# EAGLE board sanguinololu_big_light_no_fdti_chip_routed_v0.4sd_e2_fan2_EEB (EAGLE 7.6.0), part 1 of 2
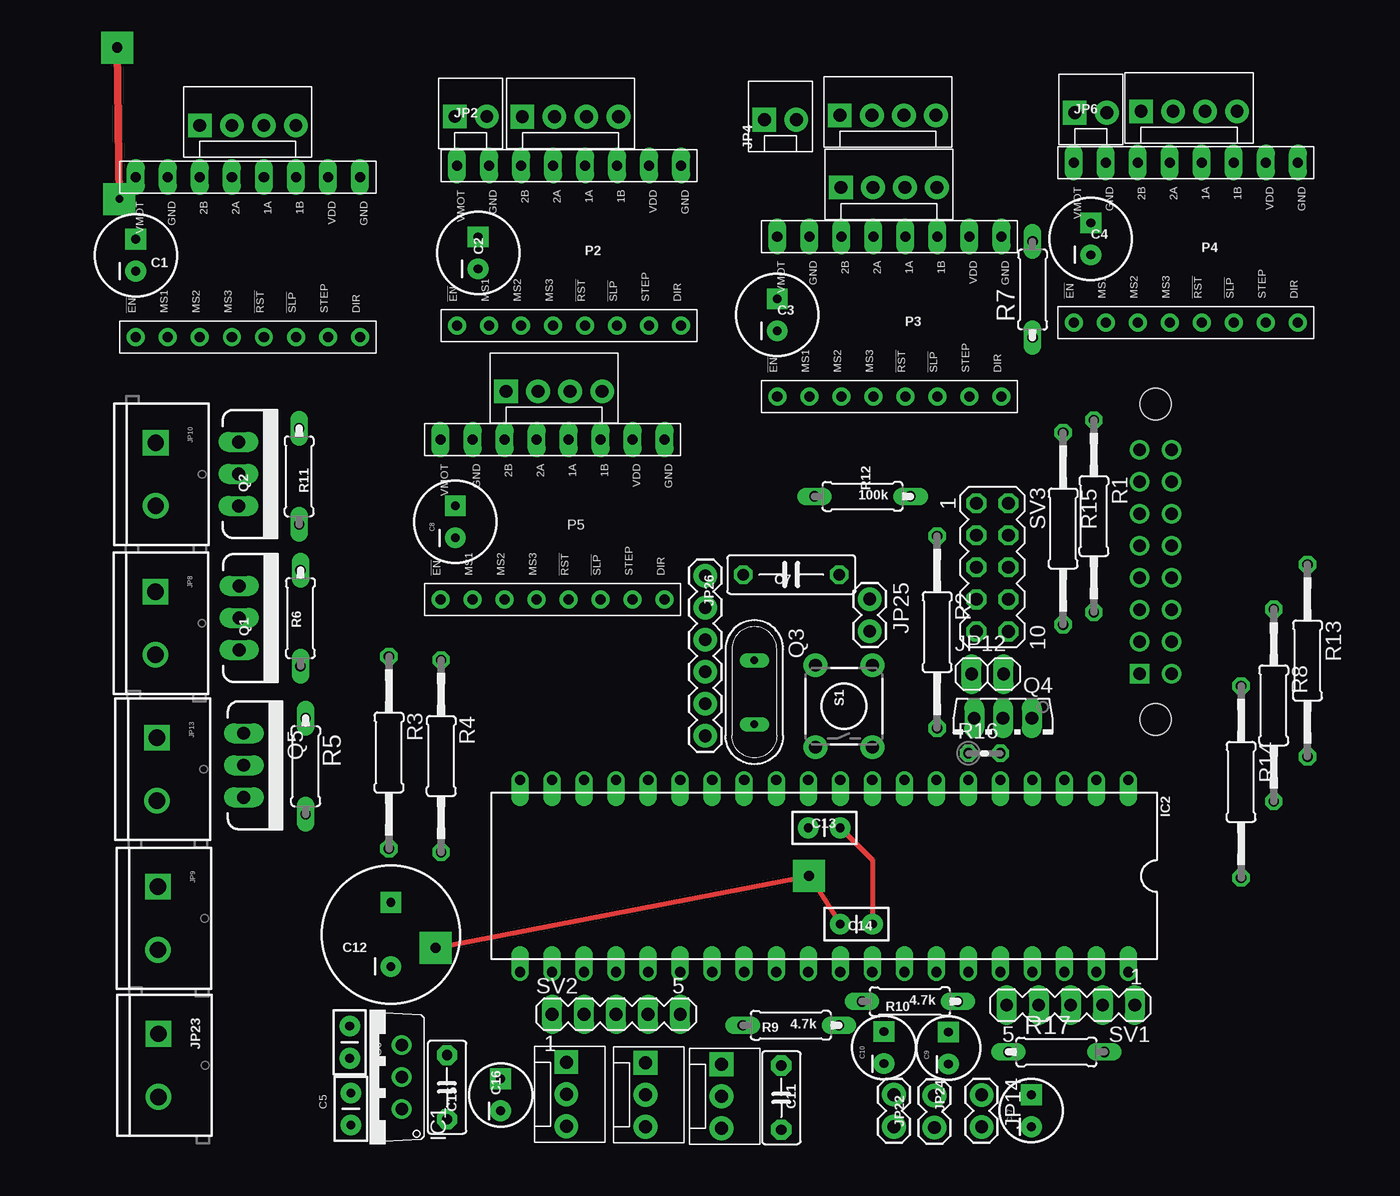
[diagram p2: board, top side]
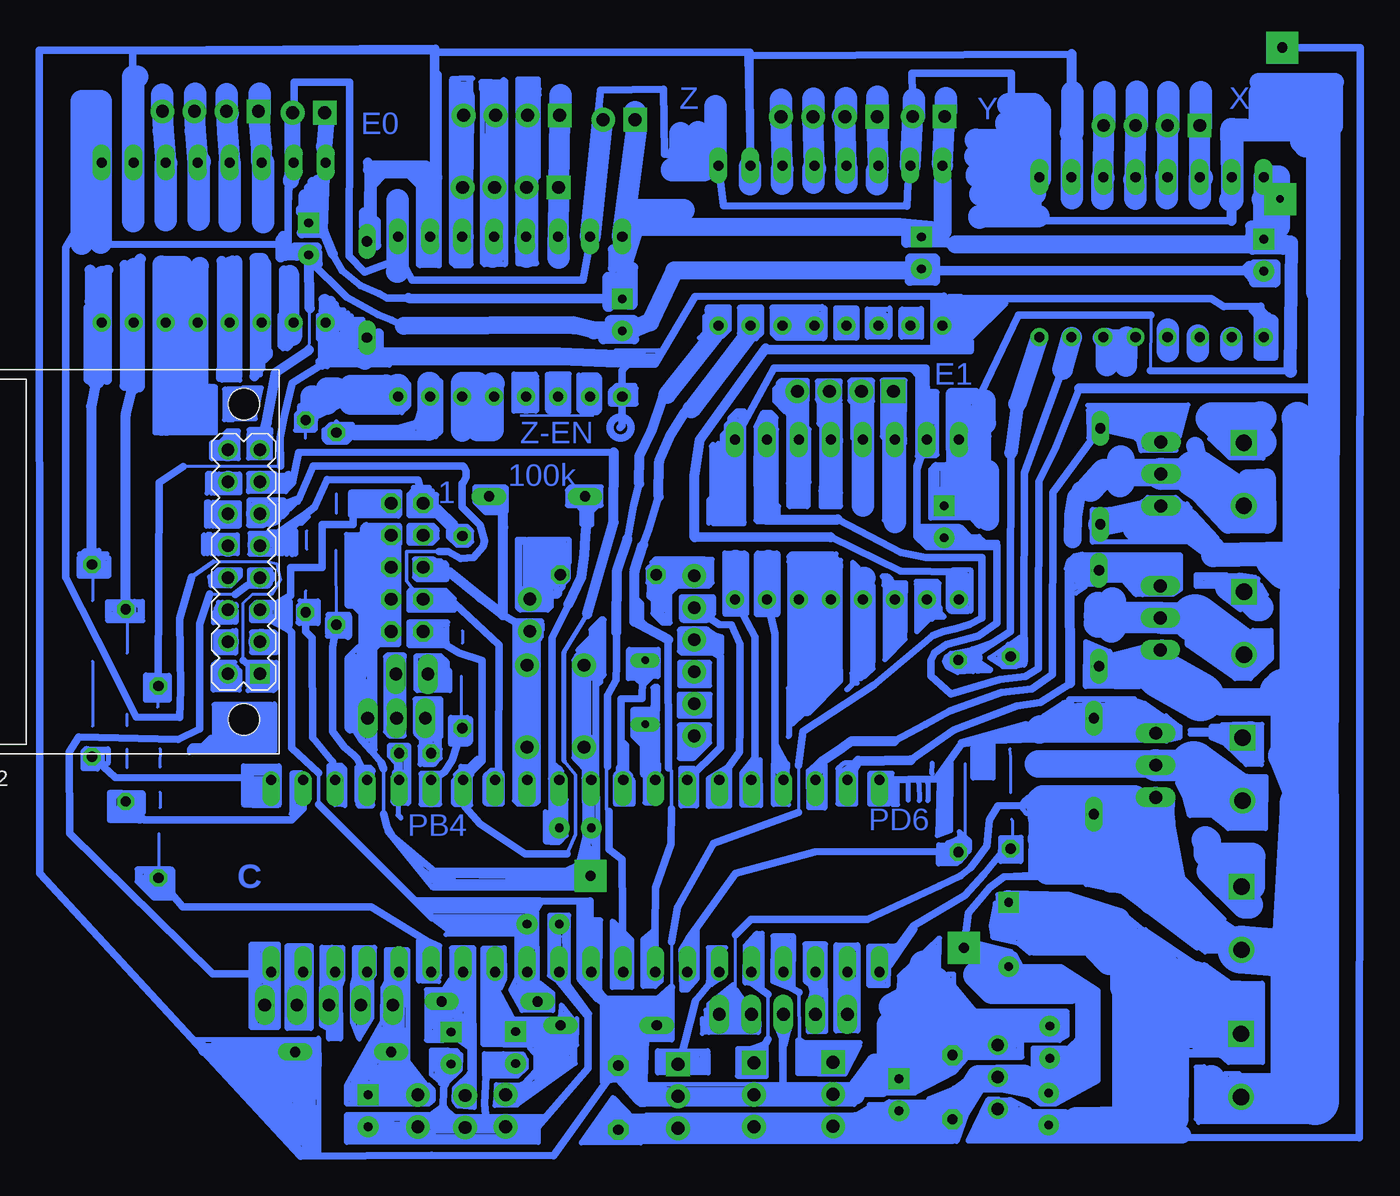
[diagram p3: board, bottom side, seen from below]

No outline drawn. Coordinates in mm, seen from the top.
Copper layers (1*16): Top 0.035mm / dielectric 1.5mm / Bottom 0.035mm
Design rules "10width10space20drill10annular *": minimum track width 11mil, minimum drill 20mil, track to track 11mil, track to pad 11mil, pad to pad 10mil, via to via 10mil, smd to smd 0mil, copper to edge 0mil, drill to drill 10mil, minimum pad ring 11mil, minimum via ring 10mil, stop-mask expansion 2mil, vias tented up to drill 25mil, thermal gap 10mil

## Footprints (pad centres in the part's own frame; a part is rotated, then mirrored left to right if it is on the bottom)
CPOL-RADIAL-100UF-25V = drill 0.7 pad 1.651 square: 1 1.27,0 | drill 0.7 pad 1.651: 2 -1.27,0
CAP-PTH-SMALL2 = drill 0.7 pad 1.651: 1 0,0; 2 2.54,0
C075-032X103 = drill 0.914 octagon: 1 -3.81,0; 2 3.81,0
CPOL-RADIAL-10UF-25V = drill 0.7 pad 1.651 square: 1 1.27,0 | drill 0.7 pad 1.651: 2 -1.27,0
C5B3 = drill 0.813 pad 1.6 octagon: 1 -2.54,0; 2 2.54,0
CPOL-RADIAL-1000UF-25V = drill 0.7 pad 1.651 square: 1 2.54,0 | drill 0.7 pad 1.651: 2 -2.54,0
78XXL-CUSTOM = drill 1.016: GND 0,0; IN -2.54,0; OUT 2.54,0
DIL40 = drill 0.813 offset: 1 -24.13,-7.62; 2 -21.59,-7.62; 3 -19.05,-7.62; 4 -16.51,-7.62; 5 -13.97,-7.62; 6 -11.43,-7.62; 7 -8.89,-7.62; 8 -6.35,-7.62; 9 -3.81,-7.62; 10 -1.27,-7.62; 11 1.27,-7.62; 12 3.81,-7.62; 13 6.35,-7.62; 14 8.89,-7.62; 15 11.43,-7.62; 16 13.97,-7.62; 17 16.51,-7.62; 18 19.05,-7.62; 19 21.59,-7.62; 20 24.13,-7.62; 21 24.13,7.62; 22 21.59,7.62; 23 19.05,7.62; 24 16.51,7.62; 25 13.97,7.62; 26 11.43,7.62; 27 8.89,7.62; 28 6.35,7.62; 29 3.81,7.62; 30 1.27,7.62; 31 -1.27,7.62; 32 -3.81,7.62; 33 -6.35,7.62; 34 -8.89,7.62; 35 -11.43,7.62; 36 -13.97,7.62; 37 -16.51,7.62; 38 -19.05,7.62; 39 -21.59,7.62; 40 -24.13,7.62
MOLEX-1X4 = drill 1.016 pad 1.88 square: 1 0,0 | drill 1.016 pad 1.88: 2 2.54,0; 3 5.08,0; 4 7.62,0
MOLEX-1X2 = drill 1.016 pad 1.88 square: 1 0,0 | drill 1.016 pad 1.88: 2 2.54,0
SCREWTERMINAL-5MM-2 = drill 1.3 pad 2.032 square: 1 0,0 | drill 1.3 pad 2.032: 2 5,0
1X02 = drill 1.016 long: 1 -1.27,0; 2 1.27,0
1X02' = drill 1.016 pad 1.88: 1 0,0; 2 2.54,0
1X06 = drill 1.016 pad 1.88: 1 0,0; 2 2.54,0; 3 5.08,0; 4 7.62,0; 5 10.16,0; 6 12.7,0
MOLEX-1X3 = drill 1.016 pad 1.88 square: 1 0,0 | drill 1.016 pad 1.88: 2 2.54,0; 3 5.08,0
POLOLU-ALLEGRO-PTH = drill 0.8 pad 1.422 long: 1A 6.35,-1.27; 1B 6.35,-3.81; 2A 6.35,1.27; 2B 6.35,3.81; GNDMOT 6.35,6.35; GNDVDD 6.35,-8.89; VDD 6.35,-6.35; VMOT 6.35,8.89 | drill 0.8 pad 1.422: !EN -6.35,8.89; !RST -6.35,-1.27; !SLP -6.35,-3.81; DIR -6.35,-8.89; MS1 -6.35,6.35; MS2 -6.35,3.81; MS3 -6.35,1.27; STEP -6.35,-6.35
TO220V = drill 1.016 long: 1 -2.54,0; 2 0,0; 3 2.54,0
QS = drill 0.61 long: 1 -2.54,0; 2 2.54,0
TO126AV = drill 1.016 long: B 2.286,-1.27; C 0,-1.27; E -2.286,-1.27
0207/15 = drill 0.813 octagon: 1 -7.62,0; 2 7.62,0
0207/7 = drill 0.813 long: 1 -3.81,0; 2 3.81,0
0204V = drill 0.813 octagon: 1 -1.27,0; 2 1.27,0
TACTILE-PTH = drill 1.016 pad 1.88: 1 -3.251,2.261; 2 3.251,2.261; 3 -3.251,-2.261; 4 3.251,-2.261
MA05-1 = drill 1.016 long: 1 -5.08,0; 2 -2.54,0; 3 0,0; 4 2.54,0; 5 5.08,0
MA05-2 = drill 1.016 octagon: 1 -5.08,-1.27; 2 -5.08,1.27; 3 -2.54,-1.27; 4 -2.54,1.27; 5 0,-1.27; 6 0,1.27; 7 2.54,-1.27; 8 2.54,1.27; 9 5.08,-1.27; 10 5.08,1.27
CARD-SD-ADAPTER = drill 1 square: 1 -21.59,8.89 | drill 1: 2 -19.05,8.89; 3 -21.59,6.35; 4 -19.05,6.35; 5 -21.59,3.81; 6 -19.05,3.81; 7 -21.59,1.27; 8 -19.05,1.27; 9 -21.59,-1.27; 10 -19.05,-1.27; 11 -21.59,-3.81; 12 -19.05,-3.81; 13 -21.59,-6.35; 14 -19.05,-6.35; 15 -21.59,-8.89; 16 -19.05,-8.89 | hole 2.5: -20.32,12.5; -20.32,-12.5

## Placement (x,y rotation side)
C1  100uf  [CPOL-RADIAL-100UF-25V]  2.54,69.58 90 top
C2  100uf  [CPOL-RADIAL-100UF-25V]  29.7,69.76 90 top
C3  100uf  [CPOL-RADIAL-100UF-25V]  53.42,64.84 90 top
C4  100uf  [CPOL-RADIAL-100UF-25V]  78.3,70.87 90 top
C5  0.33uF  [CAP-PTH-SMALL2]  19.6,0.57 90 top
C6  0.1uF  [CAP-PTH-SMALL2]  19.51,8.42 270 top
C7  0.1uF  [C075-032X103]  54.53,44.24 180 top
C8  100uf  [CPOL-RADIAL-100UF-25V]  27.89,48.43 90 top
C9  10uF  [CPOL-RADIAL-10UF-25V]  67,6.67 90 top
C10  10uF  [CPOL-RADIAL-10UF-25V]  61.88,6.71 90 top
C11  0.1uF  [C5B3]  53.74,2.74 270 top
C12  1000uF  [CPOL-RADIAL-1000UF-25V]  22.78,15.68 90 top
C13  0.1uF  [CAP-PTH-SMALL2]  55.88,24.13 0 top
C14  0.1uF  [CAP-PTH-SMALL2]  60.96,16.51 180 top
C15  0.1uF  [C5B3]  27.22,3.57 270 top
C16  4.7uF  [CPOL-RADIAL-10UF-25V]  31.48,2.96 90 top
C17  10uF  [CPOL-RADIAL-10UF-25V]  73.57,1.71 90 top
IC1  LM7805  [78XXL-CUSTOM]  23.63,4.38 90 top
IC2  ATMEGA644-20PU  [DIL40]  57.15,20.32 180 top
JP1  MOT-X  [MOLEX-1X4]  7.61,79.88 0 top
JP2  12VPWR  [MOLEX-1X2]  27.84,80.57 0 top
JP3  MOT-Y  [MOLEX-1X4]  33.2,80.57 0 top
JP4  12VPWR  [MOLEX-1X2]  52.4,80.32 0 top
JP5  MOT-Z  [MOLEX-1X4]  58.38,80.67 0 top
JP6  12VPWR  [MOLEX-1X2]  77.02,80.88 0 top
JP7  MOT-E  [MOLEX-1X4]  82.28,80.99 0 top
JP8  SCREW  [SCREWTERMINAL-5MM-2]  4.09,42.88 270 top
JP9  SCREW  [SCREWTERMINAL-5MM-2]  4.3,19.47 270 top
JP10  SCREW  [SCREWTERMINAL-5MM-2]  4.11,54.7 270 top
JP11  MOT-X  [MOLEX-1X4]  31.91,58.78 0 top
JP12  [1X02]  70.11,36.34 0 top
JP13  SCREW  [SCREWTERMINAL-5MM-2]  4.22,31.31 270 top
JP14  E1-THERM  [1X02']  69.63,2.96 270 top
JP22  E-THERM  [1X02']  62.67,2.98 270 top
JP23  SCREW  [SCREWTERMINAL-5MM-2]  4.35,7.81 270 top
JP24  B-THERM  [1X02']  65.89,2.91 270 top
JP25  AUTO RESET  [1X02']  60.75,42.29 270 top
JP26  USB2TTL  [1X06]  47.71,44.15 270 top
JP27  X-STOP  [MOLEX-1X3]  36.69,5.56 270 top
JP28  Y-STOP  [MOLEX-1X3]  42.97,5.51 270 top
JP29  Z-STOP  [MOLEX-1X3]  49,5.39 270 top
JP30  MOT-Z  [MOLEX-1X4]  58.47,74.95 0 top
P1  POLOLU-X  [POLOLU-ALLEGRO-PTH]  11.43,69.43 90 top
P2  POLOLU-Y  [POLOLU-ALLEGRO-PTH]  36.91,70.33 90 top
P3  POLOLU-Z  [POLOLU-ALLEGRO-PTH]  62.31,64.71 90 top
P4  POLOLU-E  [POLOLU-ALLEGRO-PTH]  85.83,70.58 90 top
P5  POLOLU-X  [POLOLU-ALLEGRO-PTH]  35.6,48.6 90 top
Q1  RFP30N06LE  [TO220V]  10.74,40.8 270 top
Q2  RFP30N06LE  [TO220V]  10.69,52.22 270 top
Q3  [QS]  51.6,34.9 270 top
Q4  BD139  [TO126AV]  71.33,31.57 180 top
Q5  RFP30N06LE  [TO220V]  11.1,29.11 270 top
R1  0  [0207/15]  78.53,48.88 270 top
R2  1k  [0207/15]  66.1,39.67 270 top
R3  0  [0207/15]  22.62,30.12 270 top
R4  0  [0207/15]  26.76,29.84 270 top
R5  10k  [0207/7]  16.01,29.04 270 top
R6  10k  [0207/7]  15.6,40.78 270 top
R7  100k  [0207/7]  73.68,66.85 90 top
R8  0  [0207/15]  92.8,33.87 270 top
R9  4.7k  [0207/7]  54.5,8.48 180 top
R10  4.7k  [0207/7]  63.94,10.36 180 top
R11  10k  [0207/7]  15.49,52.03 270 top
R12  100k  [0207/7]  60.18,50.44 180 top
R13  0  [0207/15]  95.48,37.41 270 top
R14  0  [0207/15]  90.21,27.79 270 top
R15  0  [0207/15]  76.09,47.89 270 top
R16  [0204V]  69.85,30.06 0 top
R17  4.7k  [0207/7]  75.56,6.36 0 top
S1  RESET  [TACTILE-PTH]  58.71,33.79 90 top
SV1  [MA05-1]  76.7,10.08 180 top
SV2  [MA05-1]  40.64,9.36 0 top
SV3  [MA05-2]  70.49,44.81 270 top
U$2  CARD-SD-ADAPTER  [CARD-SD-ADAPTER]  103.76,45.25 180 bottom

## Tracks (layer width: path | path; a pad name or v marks a point on that pad's centre or on a via)
5V
  Top 0.406: C13.2 60.96,21.59 C14.1
  Bottom 0.254: 39.46,29.11 39.45,25.35 | 49.53,15.11 49.52,11.51
  Bottom 0.279: 31.43,4.33 C16.1 31.57,4.19 | 27.24,6.01 C15.1 | 36.6,3.07 JP27.2 36.74,3.07 | 43.03,2.93 JP28.2 42.89,3.07 | 48.9,2.93 JP29.2 | 82.28,41.35 U$2.5 | 58.53,27.94 IC2.10 58.98,28.01 | 58.53,24.17 C13.2 | 55.41,12.5 IC2.30 | 82,41.5 U$2.5 | 60.25,10.5 R10.2 | 60.75,12.5 IC2.32 61,13 | 77.5,26 77.5,28.5 | 82,41 U$2.5 | 61,17 C14.1 61,16.5
  Bottom 0.406: SV2.3 40.6,9.31 40.6,3.07
  Bottom 0.61: 31.43,4.33 28.92,4.33 27.24,6.01 | 36.6,3.07 32.69,3.07 31.57,4.19 | 48.9,2.93 43.03,2.93 | 42.89,3.07 40.6,3.07 36.74,3.07 | P3.VDD 68.44,70.67 | 69.56,75.97 73.57,75.96 | 73.57,75.96 R7.2 73.53,76.12 68.14,75.95 68.22,86 92.54,85.84 99.67,85.84 99.62,20.53 86.65,6.45 78.92,-1.93 68.54,-1.85 58.86,-1.86 C11.1 | 58.53,24.17 58.53,27.94 | 57.68,41.87 58.99,39.21 58.98,28.01 | 51.59,7.37 51.73,2.98 50.71,2.98 49.25,2.75 JP29.2 | 51.59,7.37 51.21,8.33 R9.2 | 55.41,12.5 55.27,10.54 | 55.27,10.54 51.59,7.37 | 82,41.5 81.5,41.5 79.72,42.59 79.72,44.81 77.22,44.81 77.22,48.21 74.76,48.21 74.76,49.75 72,49.75 SV3.2 | 60.25,10.5 60.25,12 60.75,12.5 | 17.77,85.53 43.44,85.38 P2.VDD 43.3,85.67 68.26,85.67 68.42,75.74 | 73.57,75.96 68.4,76.07 68.4,85.81 92.24,85.81 P4.VDD | P5.VDD 41.96,48.6 | 36.31,48.62 31.31,45.99 29.35,45.59 24.89,45.59 24.91,40.8 25.89,40.27 26.9,39.97 27.93,39.74 28.77,39.39 33.44,35.48 39.1,31.79 39.46,29.11 | 39.45,25.35 46.18,22.89 49.06,17.82 49.53,15.11 | 49.52,11.51 50.52,10.6 55.27,10.54 | 82,41 79.97,39.92 79.91,39.92 79.64,39.65 79.64,30.47 77.5,28.5 | 77.5,26 68.5,17 61,17 | 61,13 61,16.5 | IC2.30 55.99,18.36 59.9,18.31 C14.1
  Bottom 0.813: 57.68,41.87 56.65,44.05 56.42,45.82 56.34,47.3 56.13,49.29 R12.2 | P1.VDD 17.77,85.53 | 41.96,48.6 36.31,48.62 | R17.2 86.65,6.45
  Bottom 1.422: 68.44,70.67 68.42,75.74 69.56,75.97
  Bottom 1.93: C6.1 23.62,8.33 IC1.OUT 27.31,6.86 C15.1 | C11.1 51.73,2.98
12V  (via drill 0.6 pad 2.54, 0.8 pad 2.54)
  Top 0.61: v1.05,86.05 v1.23,74.04
  Bottom 0.254: 11.5,64.84 11.52,60.4
  Bottom 0.279: 77.14,75.53 P4.VMOT | 76.86,80.46 JP6.1 | 52.34,79.42 JP4.1 | 53.23,69.01 P3.VMOT | 2.65,73.62 v1.23,74.04 P1.VMOT | 2.65,70.63 C1.1 | 31.44,71.81 26.98,70.44 C2.1 | 28.02,75.42 P2.VMOT | 3.02,70.45 C1.1 | 2.63,70.66 C1.1 | 52.38,71.81 52.67,71.25
  Bottom 0.61: 76.38,69.68 75.65,68.35 74.16,67.16 72.72,66.52 72.08,66.18 70.38,66.17 | 11.5,64.84 21.99,64.81 P5.VMOT 26.62,50.11 C8.1 | 11.52,60.4 0.41,60.38 | C12.1 14.1,16.11 10.34,6.7 10.36,-0.39 -5.04,-0.44 -5.08,27.64 -5.13,86.05 v1.05,86.05
  Bottom 0.813: C4.1 77.14,71.53 | 77.14,71.53 P4.VMOT | 77.14,71.53 76.38,69.68 | 70.38,66.17 53.67,66.13 53.54,66.14 | 53.54,66.14 C3.1 | P3.VMOT 53.54,66.14
  Bottom 1.016: 0.41,60.38 0.33,70.59 C1.1
  Bottom 1.27: 76.86,80.46 77.07,78.2 P4.VMOT
  Bottom 1.422: 2.65,70.63 2.65,73.62 | 28.02,75.42 28.01,71.48 31.44,71.81 52.38,71.81 53.23,69.01 | 26.98,70.44 3.02,70.45
  Bottom 1.676: P2.VMOT JP2.1 | 52.34,79.42 P3.VMOT
  Bottom 1.93: 17.39,0.91 C5.1 22.72,0.62 IC1.IN | C12.1 18.12,18.12 14.1,16.85 9.52,7.71
  Bottom 2.184: JP23.1 9.52,7.71 9.57,1.08 17.39,0.91
!FTDI-RESET
  Bottom 0.279: 58.35,44.1 C7.1 | 60.63,42.33 JP25.1
  Bottom 0.61: 58.35,44.1 58.95,44.01 60.63,42.33
!HEATBED
  Bottom 0.61: IC2.20 28.5,28.04 26.5,30.81 19.73,31.7 R5.1 Q5.1
!HOTBED
  Bottom 0.61: 31.83,31.02 29.38,32.35 27.41,33.44 23.33,34.9 20.91,35.17 19.3,36.31 19.26,50.76 R11.1 Q2.1
  Bottom 0.813: IC2.18 38.1,28.12 37.57,29.43 35.99,30.47 35.23,31.02 31.83,31.02
!HOTEND
  Bottom 0.61: 30.54,29.52 27.12,31.93 22.11,33.82 20.26,34.1 17.88,35.62 | R6.1 Q1.1
  Bottom 0.813: IC2.19 34.72,29.47 30.54,29.52 | 17.88,35.62 17.92,44.39 R6.1
!RESET
  Bottom 0.279: 61.05,27.94 IC2.9 | 61.05,30.45 S1.3 61.05,30.59 | 60.77,39.81 JP25.2 60.91,39.81 | 60.91,37.16 S1.4 61.05,37.02
  Bottom 0.61: 61.05,30.45 61.05,27.94 | 60.77,39.81 62.88,41.02 | 67.11,44.4 SV3.5 | 60.91,39.81 60.91,37.16 | 61.05,37.02 61.05,30.59
  Bottom 0.813: R12.1 62.88,49.06 62.86,48.01 62.88,41.02 64.68,42.42 67.11,44.4
!STEP-ENABLE
  Bottom 0.279: 2.54,63.2 P1.!EN | 27.61,63.83 P2.!EN | 72.83,61.57 73.41,61.11 73.21,61.96 | 53.44,58.6 P3.!EN | 88.24,52.81 80.5,52.83 | 73.5,62.5 R7.1
  Bottom 0.61: 2.54,63.2 2.78,65.53 5.69,65.51 6.67,66.12 7.55,66.13 26.32,66.12 26.26,64.77 27.61,63.83 | 73.41,61.11 73.83,61.2 76.87,61.12 79.61,59.41 80.21,56.91 80.54,55.12 80.5,52.83 | 88.24,52.81 90.15,51.55 R14.1 | 53.19,60.68 52.94,60.92 50.83,60.92 47.63,66.31 27.91,66.33 P2.!EN 28.33,62.17 42.05,62.17 | 53.19,60.68 53.44,60.42 53.44,59.23 P3.!EN | P5.!EN 26.54,44.44 31.36,44.51 36.87,47.21 | 53.7,61.38 53.19,60.68
  Bottom 0.813: 36.87,47.21 47.67,47.18 47.7,52.04 47.27,54.94 42.05,62.17
  Bottom 1.422: 53.7,61.38 58.45,61.56 72.83,61.57 | 73.83,61.2 75.91,62.02 P4.!EN | 73.21,61.96 73.5,62.5
#DTR
  Bottom 0.61: JP26.1 C7.2
A0
  Bottom 0.279: 81.31,12.57 IC2.40 81.44,12.57 | 81.72,10.2 SV1.1 | 86.14,42.68 84.11,42.66 | 82.28,43.87 U$2.7
  Bottom 0.61: 81.31,12.57 81.31,10.62 81.72,10.2 | 82.28,43.87 83.19,43.38 84.11,42.66 | 86.14,42.68 86.93,40.31 86.93,39.38 86.94,38.12 86.94,32.01 88.65,31.18 96.52,31.34 97.3,30.18 97.26,23.7 85.9,12.57 81.44,12.57
A1
  Bottom 0.279: 78.79,12.57 IC2.39
  Bottom 0.61: 78.79,12.57 78.79,10.62 79.21,10.2 SV1.2
A2
  Bottom 0.279: 76.28,12.57 IC2.38
  Bottom 0.61: 76.28,12.57 76.28,10.62 76.69,10.2 SV1.3
A3
  Bottom 0.279: 74.04,10.2 73.76,10.48 | 73.76,12.57 IC2.37
  Bottom 0.61: 73.76,10.48 73.76,12.57 | 74.04,10.2 SV1.4
A4
  Bottom 0.279: 71.53,10.2 71.25,10.48 | 71.25,12.57 IC2.36
  Bottom 0.61: 71.25,10.48 71.25,12.57 | 71.53,10.2 SV1.5
  Bottom 0.813: SV1.5 R17.1 JP14.1 C17.1
AIFO
  Bottom 0.61: JP26.3 45.62,37.76 45.63,33.46 45.61,30.51 IC2.14
AOFI
  Bottom 0.61: JP26.2 45.73,40.27 44.74,40.26 44.07,38.74 44.08,32.34 44.11,30.16 IC2.15
B-THERM
  Bottom 0.279: 67.61,10.34 R10.1 67.61,10.48 | 67.06,7.96 C9.1 66.92,7.82 | 66.08,12.57 IC2.34 | 65.43,5.02 65.5,4.65 | 65.8,2.93 JP24.1
  Bottom 0.61: 67.61,10.34 67.61,8.52 67.06,7.96 | 66.08,12.57 66.08,12.01 67.61,10.48 | 65.5,4.65 65.8,2.93 | 65.43,5.02 65.43,6.7 66.92,7.82
E-DIR
  Bottom 0.61: IC2.1 82.5,27.94 83.31,28.13 93.63,28.14 R13.2
E-MOT-1A
  Bottom 1.676: JP7.3 87.3,79.43 P4.1A
E-MOT-1B
  Bottom 1.676: JP7.4 89.84,79.43 P4.1B
E-MOT-2A
  Bottom 1.676: JP7.2 84.76,79.43 P4.2A
E-MOT-2B
  Bottom 1.676: P4.2B 82.01,78.08 JP7.1
E-RESETSLEEP
  Bottom 1.422: P4.!RST P4.!SLP
E-STEP
  Bottom 0.61: IC2.2 78.74,25.67 79.64,24.77 91.32,24.77 R8.2
E-THERM
  Bottom 0.279: 61.96,8.6 61.75,8.1 C10.1 61.75,7.96 | 63.42,12.57 IC2.33 | 61.23,3.73 61.37,3.73 | 62.59,3.07 JP22.1
  Bottom 0.61: R9.1 57.43,8.31 61.07,8.31 61.96,8.6 63.42,11.32 63.42,12.57 | 61.37,3.73 62.59,3.07 | 61.23,3.73 60.17,4.89 60.17,6.84 61.75,7.96
GND  (via drill 0.8 pad 2.54)
  Top 0.406: v26.33,14.61 v55.92,20.35 56.41,19.69 C14.2
  Bottom 0.254: 44.43,11.2 44.43,15.64 | 78.26,62.05 78.23,63.01 78.22,65.35 | 83.49,37.42 83.49,41.98 82.74,42.68 81.21,42.68 80.5,43.83 80.8,45.09 81.54,45.25 83.89,45.25 85.87,45.24
  Bottom 0.279: 55.02,80.07 JP4.2 55.34,80.7 | 71.35,69.93 P3.GNDVDD 71.2,69.23 | 55.96,70.67 P3.GNDMOT | 45.9,76.86 P2.GNDVDD | 30.76,75.17 P2.GNDMOT | 79.72,75.45 P4.GNDMOT | 79.27,79.26 JP6.2 79.5,80 | 72.36,25.25 72.37,26.05 72.37,28.83 | 58.53,12.71 IC2.31 | 58.53,16.48 C14.2 | 56.44,30.45 S1.1 56.44,30.59 | 56.44,37.02 S1.2 | 62.31,5.31 61.89,5.31 | 62.73,0.56 JP22.2 | 67.6,3.49 67.48,3.77 | 67.06,5.31 C9.2 | 65.94,0.42 JP24.2 65.8,0.42 | 64.73,1.06 64.45,1.06 64.24,0.94 | 48.9,0.42 JP29.3 | 43.03,0.42 JP28.3 42.89,0.42 | 31.43,1.68 C16.2 31.57,1.68 | 27.24,1.12 C15.2 | 36.6,0.56 JP27.3 36.74,0.42 | 44,54.5 P5.GNDVDD | 24.5,24 24.39,23.99 | 47,0.5 47,0.42 | 95,39 95.01,38.99 | -1,59 -2.22,59
  Bottom 0.406: C12.2 v26.33,14.61 | v55.92,20.35 55.6,20.68 56.4,20.67 C13.1 | 85.87,45.24 87.57,44.05
  Bottom 0.61: 71.35,69.93 70.11,67.6 56.52,67.6 55.96,70.67 | 45.9,76.86 50.07,77.6 50.13,82.73 55.13,82.67 55.34,80.7 | 30.76,75.17 30.82,73.48 45.39,73.49 P2.GNDVDD | 74.71,33.72 74.37,35.01 73.42,38.1 SV3.10 71.73,39.44 71.78,40.31 SV3.8 71.85,41.55 71.88,43.04 SV3.6 71.76,44.23 71.83,45.14 71.78,45.5 SV3.4 | 74.71,33.72 74.7,32.93 74.59,31.94 74.06,31.09 73.33,30.29 72.53,29.32 72.37,28.83 | 58.53,16.48 58.53,12.71 56.12,9.18 56.12,5.09 60.13,0.44 JP22.2 | 56.44,30.45 55.88,29.9 IC2.11 C13.1 | 56.44,30.59 56.44,37.02 | 56.4,20.67 68.29,20.67 71.69,23.5 72.08,24.18 72.36,25.25 | 62.31,5.31 64.22,4.48 64.36,2.24 64.24,0.94 62.73,0.56 | 61.89,5.31 C10.2 | 67.48,3.77 67.06,5.31 | 67.6,3.49 67.63,1.88 65.94,0.42 | 65.8,0.42 64.73,1.06 | 43.03,0.42 47,0.42 48.9,0.42 | 31.43,1.68 27.8,1.68 27.24,1.12 | 36.6,0.56 32.69,0.56 31.57,1.68 | 36.74,0.42 42.89,0.42 | SV2.4 44.43,11.2 SV2.5 | 44.43,15.64 43.22,16.89 33.98,16.89 28.27,19.54 26.58,20.33 25.8,20.97 25.37,21.51 24.51,22.72 24.39,23.99 24.31,24.76 23.64,25.89 20.06,25.95 20.22,20.43 23.13,20.24 | 70.73,63.96 71.72,64.44 72.8,64.85 75.3,66.23 78.3,69.2 C4.2 79.45,69.82 79.91,70.05 79.93,74.91 | 79.72,75.45 79.93,74.91 | 79.93,74.91 79.86,75.11 79.91,73.58 79.91,70.43 94.39,70.41 94.41,74.21 94.45,75.38 | 94.45,75.38 P4.GNDVDD | 71.2,69.23 73.87,68.22 75.07,69.52 75.03,80.33 75.03,83.31 79.45,83.31 79.5,80 | 29.34,60.63 P5.GNDMOT 30.05,52.8 30.04,47.41 29.17,47.16 C8.2 | 29.34,60.63 41.39,60.63 P5.GNDVDD | 29.34,60.63 29.3,55.04 30.04,52.6 30.04,47.37 26.86,47.1 23.7,46.55 23.72,40.39 25.16,39.38 27.73,38.71 28.68,38 28.95,37.43 28.92,36.19 27.34,34.76 23.46,35.91 21.42,36.16 20.4,36.79 20.39,38.05 20.38,51.6 19.04,54.36 17.17,59.01
  Bottom 0.61: U$2.1 83.49,37.42 | 87.57,44.05 88.51,40.75 88.47,35.13 88.51,32.91 91.97,32.94 95.01,38.99 97.55,44.02 97.57,70.16 94.45,75.38 | Q4.E 74.71,33.72 | Q2.3 R11.2 | Q1.3 R6.2 | Q5.3 R5.2 15.66,20.29 23.13,20.24 | P1.GNDVDD 20.54,72.3 5.1,72.3 22.68,72.33 22.57,84.01 30.44,84.01 JP2.2 | v26.33,14.61 25.96,17.41 25.07,18.45 24.26,19.44 23.13,20.24
  Bottom 0.813: U$2.15 81.62,56.29 80.86,60.3 78.26,62.05 | 78.22,65.35 78.23,66.68 C4.2 | P1.GNDMOT 5.1,72.3 | C1.2 30.24,68.36 | -1,59 15.06,59 17.17,59.01 | 67.63,1.88 JP14.2 C17.2
  Bottom 1.27: 79.72,75.45 79.56,75.91 JP6.2
  Bottom 1.422: 70.73,63.96 57.27,64.01 55.68,63.63 C3.2 52.37,63.77 51.21,64.27 49.28,68.37 30.24,68.36 C2.2
  Bottom 1.676: P2.GNDMOT JP2.2 | 55.02,80.07 P3.GNDMOT | 10.81,24.52 Q5.3 | R6.2 10.59,38.26 10.71,36.33 | P1.GNDMOT 5.14,79.65 -2.29,79.4
  Bottom 1.93: C15.2 25.16,4.37 IC1.GND 21.57,4.38 C5.2 C6.2 16.44,4.81 16.52,7.26 16.52,10.79 18.73,12.29 21.82,12.26 v26.33,14.61 | C11.2 JP29.3 | R11.2 10.54,49.26 6.57,46.31 6.51,45.8 0.28,45.91 0.34,33.73 1.25,34.12
  Bottom 2.184: 7.54,34.52 5.89,34.12 1.25,34.12 0.91,34.12 0.91,29.87
  Bottom 2.54: JP9.2 9.6,17.94 10.81,24.52 | 0.91,29.87 -0.35,26.71 | -0.35,26.71 -0.62,26.02 | -2.29,79.4 -2.22,59 -2.12,27.2 -0.35,26.71
  Bottom 3.81: JP23.2 0.06,2.83 0.06,13.83 | 0.06,13.83 0.06,14.11 JP9.2 | 10.71,36.33 7.54,34.52 | -0.62,26.02 0.06,13.83
HOTBED-GND
  Bottom 2.54: Q2.2 7.87,52.24
  Bottom 3.81: 7.87,52.24 JP10.2
HOTEND-GND
  Bottom 2.54: Q1.2 7.98,40.79
  Bottom 3.81: 7.98,40.79 JP8.2
HOTEND-GND1
  Bottom 2.54: Q5.2 8.12,29.13
  Bottom 3.81: 8.12,29.13 JP13.2
N$2
  Bottom 0.254: 45.62,9.46 45.74,9.35
N$3
  Bottom 0.279: 68.78,49.48 SV3.1 69.11,49.58
  Bottom 0.61: 68.78,49.48 67.98,49.33 67.7,48.74 67.02,48.09 66.69,47.62 R2.1 | 69.11,49.58 69.63,51.74 76.81,51.77 77.84,49.59 78.55,49.02 U$2.9
N$4
  Bottom 0.61: 18.5,60.52 21.51,52.28 21.55,39.11 22.37,38.25 R3.1
  Bottom 1.676: P1.STEP 18.5,60.52
N$5
  Bottom 0.61: 22.6,53.89 22.63,42 22.64,39.72 25.93,37.59
  Bottom 1.016: 22.09,57.78 22.6,53.89 | 25.93,37.59 R4.1
  Bottom 1.422: P1.DIR 22.09,57.78
N$6
  Bottom 1.676: 5.03,75.69 5.03,79.56 4.96,79.63
N$7
  Bottom 0.813: R8.1 92.8,56.92 92.23,59.25 | 92.3,63.61 P4.STEP
  Bottom 1.422: 92.23,59.25 92.3,63.61
N$8
  Bottom 0.813: 95.16,59.64 95.56,57.59 95.56,45.11 R13.1
  Bottom 1.422: P4.DIR 95.16,59.64
N$9
  Bottom 0.279: 51.78,37.41 Q3.1 | 53.5,28.1 IC2.12
  Bottom 0.61: 51.78,37.41 51.84,34.39 53.52,34.37 53.5,28.1
N$10
  Bottom 0.279: 51.55,32.27 Q3.2 | 50.85,27.94 IC2.13
  Bottom 0.61: 51.55,32.27 51.55,28.64 50.85,27.94
N$11
  Bottom 0.279: 68.59,12.71 IC2.35
  Bottom 0.61: 68.59,12.71 68.63,14.99 73.34,17.88 88.29,17.88 R14.2
N$12
  Bottom 0.813: 74.8,58.34 R1.1
  Bottom 1.422: P3.DIR 74.8,58.34
N$13
  Bottom 0.813: 69.26,56.25 71.2,55.71 74.87,55.7 R15.1
  Bottom 1.422: P3.STEP 69.26,56.25
N$15
  Bottom 2.54: -0.24,28.67 -0.24,56.61 -0.16,56.69
N$28
  Bottom 2.54: 1.88,45.34 1.88,45.26 0.98,44.36
N$29
  Bottom 2.54: 1.55,34.23 1.55,35.05 1.14,35.45
N$34
  Bottom 2.54: 2.78,54.75 4.59,54.75 6.67,56.65 2.88,56.65 2.78,56.73
N$44
  Bottom 1.422: JP11.1 P5.2B
N$45
  Bottom 1.422: JP11.2 P5.2A
N$46
  Bottom 1.422: JP11.3 P5.1A
N$47
  Bottom 1.422: JP11.4 P5.1B
N$48
  Bottom 0.254: 95.43,45.14 95.43,42.16
N$49
  Bottom 1.676: P5.!RST P5.!SLP
N$50
  Bottom 0.61: Q4.C JP12.2
N$52
  Bottom 0.61: 53.44,58.38 53.44,56.06 53.61,55.89
N$53
  Bottom 0.61: Q4.B R16.1
N$54
  Bottom 0.254: 92.69,41.36 92.69,38.01
N$55
  Bottom 0.254: 90.29,35.36 90.29,33.71
N$56
  Bottom 0.254: 95.43,37.35 95.43,32.2
N$57
  Bottom 0.254: 92.7,28.91 92.7,30.38
N$58
  Bottom 0.254: 92.7,32.27 92.7,33.17
N$59
  Bottom 0.254: 90.09,30.42 90.11,29.15 90.09,28.98 90.1,28.95
N$60
  Bottom 0.254: 90.09,26.96 90.09,25.73
N$61
  Bottom 0.254: 90.17,23.69 90.17,20.67
N$62
  Bottom 0.254: 76.1,40.5 76.12,46.15
N$63
  Bottom 0.254: 78.52,41.7 78.52,42.95
N$64
  Bottom 0.254: 78.45,46.26 78.45,47.73
N$65
  Bottom 0.254: 78.56,56.3 78.56,55.03
N$66
  Bottom 0.254: 76.06,55.35 76.06,54.66
N$67
  Bottom 0.254: 76.11,50.64 76.11,49.09
N$68
  Bottom 0.254: 66.18,32.44 66.18,36.17
N$69
  Bottom 0.254: 66.09,39.8 66.09,38.81
N$71
  Bottom 1.778: 5.1,62.98 5.1,62.1
N$72
  Bottom 1.778: 7.75,63.19 7.75,61.96
N$73
  Bottom 1.778: 10.13,63.66 10.13,61.96
N$74
  Bottom 1.778: 2.31,63.87 2.31,62.17
N$75
  Bottom 1.778: 13.4,63.05 13.47,60.81
N$76
  Bottom 1.778: 14.96,62.91 14.96,60.87
N$77
  Bottom 1.778: 2.59,74.03 2.46,74.03 2.46,75.81 1.34,75.81 1.34,71.84
N$78
  Bottom 1.778: 7.44,75.74 7.6,75.74 7.6,74.1
N$79
  Bottom 1.778: 10.26,75.81 10.22,75.81 10.22,74.1
N$80
  Bottom 1.778: 12.78,75.58 12.71,75.58 12.71,74.07
N$81
  Bottom 1.778: 15.27,75.74 15.34,75.74 15.34,74.07
N$82
  Bottom 1.778: 17.76,74.1 17.76,78.53
N$83
  Bottom 1.778: 20.29,75.64 20.29,80.98
N$84
  Bottom 1.778: 5.18,73.94 5.05,73.94 5.05,79.47 -1.61,79.47 -1.61,79.54 -1.7,79.54 -1.7,66.63
N$85
  Bottom 1.778: 2.69,80.52 2.85,80.52 2.85,82.42
N$86
  Bottom 1.778: 2.65,82.65 -1.64,82.65 -1.64,80.33
N$87
  Bottom 1.778: -1.02,80.98 1.28,80.98 1.28,81.21
N$88
  Bottom 1.778: -0.46,78.59 -0.75,78.59 -0.75,78.23
N$89
  Bottom 1.778: 7.54,79.77 7.54,82.49
N$90
  Bottom 1.778: 10.22,79.67 10.09,79.67 10.09,82.49
N$91
  Bottom 1.778: 12.65,79.87 12.62,79.87 12.62,82.56
N$92
  Bottom 1.778: 15.21,79.84 15.17,79.84 15.17,82.49
N$93
  Bottom 1.778: 17.83,79.31 17.7,79.31 17.7,82.49
N$94
  Bottom 1.778: 20.42,72.66 25.1,72.66 25.1,72.56
N$95
  Bottom 1.778: 20.68,74.46 25,74.46 25,74.36
N$96
  Bottom 1.778: 20.32,75.84 25.3,75.84 25.3,76
N$97
  Bottom 1.778: 20.71,77.38 25.4,77.38 25.4,77.41
N$98
  Bottom 1.778: 20.74,78.69 25.36,78.69 25.36,78.72
N$99
  Bottom 1.778: 20.84,79.97 22.94,79.97 22.94,80.1
N$100
  Bottom 1.778: 20.78,81.54 22.77,81.54 22.77,81.47
N$101
  Bottom 1.778: 30.53,63.92 30.53,64.48
N$102
  Bottom 1.778: 33.05,63.85 33.05,64.4
N$103
  Bottom 1.778: 35.64,63.81 35.64,64.4
N$104
  Bottom 1.778: 38.36,63.92 38.36,64.48
N$105
  Bottom 1.778: 40.64,63.85 40.64,64.44
N$106
  Bottom 1.778: 43.27,63.85 43.27,64.44
N$107
  Bottom 1.778: 45.83,63.96 45.87,63.96 45.87,64.59
N$108
  Bottom 1.778: 52.16,73.15 48.57,73.15
N$109
  Bottom 1.778: 46.04,77.23 46.04,81.39
N$110
  Bottom 1.778: 47.42,77.72 47.42,79.35
N$111
  Bottom 1.778: 48.89,77.8 48.81,77.8 48.81,79.27
N$112
  Bottom 1.778: 46.93,76.33 49.47,76.33 49.47,76.41
N$113
  Bottom 1.778: 33.19,76.26 33.23,76.26 33.23,75.22
N$114
  Bottom 1.778: 35.69,76.44 35.64,76.44 35.64,75.31
N$115
  Bottom 1.778: 38.14,76.44 38.24,76.44 38.24,75.31
N$116
  Bottom 1.778: 40.69,76.4 40.74,76.4 40.74,75.27
N$117
  Bottom 1.778: 43.29,76.59 43.29,75.22
N$118
  Bottom 1.778: 27.73,80.99 27.73,82.02
N$119
  Bottom 1.778: 30.41,80.6 30.29,80.6 30.29,81.94
N$120
  Bottom 1.778: 33.16,80.6 33.16,82.13
N$121
  Bottom 1.778: 35.92,80.6 35.68,80.6 35.68,82.02
N$122
  Bottom 1.778: 38.2,80.6 38.24,80.6 38.24,81.98
N$123
  Bottom 1.778: 40.8,80.56 40.83,80.56 40.83,81.9
N$124
  Bottom 1.778: 52.37,80.11 52.42,80.11 52.42,80.9
N$125
  Bottom 1.778: 58.32,80.84 58.32,82.26
N$126
  Bottom 1.778: 60.75,80.62 60.81,80.62 60.81,82.03
N$127
  Bottom 1.778: 63.42,80.73 63.47,80.73 63.47,82.15
N$128
  Bottom 1.778: 65.91,80.62 66.03,80.62 66.03,82.09
N$129
  Bottom 1.778: 58.49,70.81 58.49,69.39
N$130
  Bottom 1.778: 61.04,70.86 61.09,70.86 61.01,69.46
N$131
  Bottom 1.778: 63.65,70.92 63.7,70.92 63.7,69.45
N$132
  Bottom 1.778: 66.08,71.03 66.14,71.03 66.14,69.5
N$133
  Bottom 1.778: 68.63,70.81 68.69,70.81 68.69,69.56
N$134
  Bottom 1.778: 71.3,68.26 71.24,68.26 71.24,73.93
N$135
  Bottom 1.778: 41.95,54.94 41.95,49.08
N$136
  Bottom 1.778: 44.53,54.98 44.53,49.08
N$137
  Bottom 1.778: 31.72,54.94 31.79,54.94 31.79,48.42
N$138
  Bottom 1.778: 34.31,54.88 34.31,49.73
N$139
  Bottom 1.778: 36.8,54.88 36.83,54.88 36.83,50.84
N$140
  Bottom 1.778: 39.39,55.01 39.42,55.01 39.42,52.02
N$141
  Bottom 1.778: 26.63,55.11 26.83,55.11 26.83,50.16
N$142
  Bottom 1.778: 25.06,55.39 25.37,55.39 25.37,50.12
N$143
  Bottom 1.778: 26.83,55.98 26.63,55.98 26.63,57.79
N$144
  Bottom 1.778: 24.67,56.25 24.7,56.25 24.7,58.02
N$145
  Bottom 1.778: 24.43,48.74 24.43,48.62 24.43,52.44
N$146
  Bottom 1.778: 26.71,42.29 26.75,42.29 26.75,43.94
N$147
  Bottom 1.778: 29.23,42.84 29.23,41.5
N$148
  Bottom 1.778: 31.71,42.6 31.67,42.6 31.67,39.81
N$149
  Bottom 1.778: 34.23,43.98 34.3,43.98 34.3,37.92
N$150
  Bottom 1.778: 36.78,44.92 36.94,44.92 36.94,36.19
N$151
  Bottom 1.778: 38.4,45.12 38.4,35.09 39.46,35.09 39.46,45.16
N$152
  Bottom 1.778: 41.9,42.17 41.82,42.17 41.82,45.32
N$153
  Bottom 1.778: 44.45,42.29 44.45,45.32
N$154
  Bottom 1.778: 55.94,59.2 56.02,59.2 56.02,57.79
N$155
  Bottom 1.778: 58.42,59.36 58.46,59.36 58.46,57.95
N$156
  Bottom 1.778: 60.98,59.36 61.05,59.36 61.05,57.87
N$157
  Bottom 1.778: 63.61,59.4 63.69,59.4 63.69,55.7 64.91,55.7 64.91,59.44 66.13,59.44 66.13,55.66
N$158
  Bottom 1.778: 68.65,59.44 68.77,59.44 68.77,55.74
N$159
  Bottom 1.778: 71.17,59.28 71.28,59.28 71.28,57.79 74.98,57.79 74.98,59.2 72.15,59.2 72.15,59.24
N$160
  Bottom 1.778: 76.08,59.01 76.83,59.01 76.83,57.79
N$161
  Bottom 1.778: 77.93,58.38 78.05,58.38 78.05,57.4
N$162
  Bottom 1.778: 82.22,80.9 82.19,80.9 82.19,82.37
N$163
  Bottom 1.778: 84.73,80.82 84.79,80.82 84.79,82.34
N$164
  Bottom 1.778: 87.36,80.95 87.3,80.95 87.3,82.37
N$165
  Bottom 1.778: 89.87,80.92 89.9,80.92 89.9,82.29
N$166
  Bottom 1.778: 81.89,76.91 81.92,76.91 81.92,72.21
N$167
  Bottom 1.778: 84.54,76.88 84.57,76.88 84.57,72.27
N$168
  Bottom 1.778: 86.95,76.99 87.03,76.99 87.03,72.38
N$169
  Bottom 1.778: 89.59,76.88 89.65,76.88 89.65,72.35
N$170
  Bottom 1.778: 91.92,83.74 92.22,83.74 92.22,72.27
N$171
  Bottom 1.778: 94.79,70.55 94.79,81.79 96.3,81.79 96.3,70.51
N$172
  Bottom 1.422: 79.49,64.27 79.54,64.27 79.54,63.09
N$173
  Bottom 1.422: 79.78,68.1 79.78,64.7
N$174
  Bottom 1.422: 81.95,62.34 81.95,68.81
N$175
  Bottom 1.422: 84.5,60.4 84.5,68.76
N$176
  Bottom 1.422: 86.93,68.72 86.97,68.72 86.97,56.06 88.22,56.06 88.22,68.8 89.56,68.8 89.56,55.98 89.95,55.98 89.95,68.84
N$177
  Bottom 1.422: 92.08,64.04 92.16,64.04 92.16,68.65
N$178
  Bottom 1.422: 94.75,64.24 94.67,64.24 94.67,68.02
N$181
  Bottom 2.184: 2.83,41.62 2.99,41.62 4.52,43.15
N$182
  Bottom 2.184: 4.41,43.23 5.27,43.23 5.31,43.27
N$183
  Bottom 2.184: 3.71,30.2 3.71,30.34 4.85,31.47 3.62,31.47 3.6,31.5
N$184
  Bottom 2.184: 3.7,18.02 4.05,18.02 6.76,20.73 4.76,20.73 3.54,19.51 3.54,21.83 3.5,21.87 6.8,21.87 7,22.07 7,23.05 7.16,23.21
N$185
  Bottom 2.184: 11.26,2.45 11.26,7.59 11.18,7.67
N$186
  Bottom 2.184: 12.97,2.12 12.97,7.92 11.91,8.98
N$187
  Bottom 2.184: 6.69,4.25 6.69,1.88
N$188
  Bottom 2.184: 3.75,9.55 8.57,9.55 8.65,9.47
N$189
  Bottom 2.184: 4.57,10.94 9.55,10.94 10.36,11.76
N$190
  Bottom 2.184: 7.92,12.49 9.63,12.49 12.24,15.11
N$191
  Bottom 2.184: 13.46,2.04 13.46,15.6 13.63,15.76 13.63,11.51 12.16,10.04
N$192
  Bottom 2.184: 12.24,24.09 12.24,19.19 11.42,18.37
N$193
  Bottom 2.184: 11.75,29.23 20.4,29.23
N$194
  Bottom 2.184: 10.85,40.99 15.71,40.99
N$195
  Bottom 2.184: 14.52,42.13 14.52,40.01 14.61,39.93
N$196
  Bottom 2.184: 15.68,41.77 15.68,40.3 15.73,40.37
N$197
  Bottom 2.184: 10.77,52.34 15.18,52.34 16.28,51.1
N$198
  Bottom 2.184: 13.87,53.4 13.87,51.52 13.95,51.44
N$199
  Bottom 2.184: 9.95,47.77 12.48,47.77 12.65,47.93
N$200
  Bottom 2.184: 9.95,56.09 11.26,56.09 11.42,55.93
N$201
  Bottom 2.184: 10.19,56.49 14.27,56.49 14.93,56.59 12.97,56.59 12.81,56.42
N$202
  Bottom 2.184: 10.44,44.74 17.1,44.61
N$203
  Bottom 2.184: 10.85,32.01 20.23,32.01 20.32,31.93
N$204
  Bottom 2.184: 12.65,33.31 18.62,32.59
N$205
  Bottom 2.184: 11.75,25.07 20.15,25.07
N$206
  Bottom 2.184: 12.81,26.45 20.07,26.45 20.23,26.29
N$207
  Bottom 2.184: 13.38,23.27 20.15,23.27 20.03,23.35
N$208
  Bottom 2.184: 13.05,21.56 19.66,21.56 19.75,21.64
N$209
  Bottom 2.184: 12.56,36.25 14.12,36.25 14.2,36.34
N$210
  Bottom 2.184: 13.3,20.09 14.61,20.09 15.26,20.74 19.66,20.74 19.75,20.82
N$211
  Bottom 2.184: 14.85,15.51 16.89,15.51 17.46,16.32 23.09,16.32 22.95,16.7
N$212
  Bottom 2.184: 14.77,13.55 15.75,14.53
N$213
  Bottom 2.184: 16.89,15.11 20.64,15.11 20.97,15.43
N$214
  Bottom 2.184: 17.87,11.27 24.07,11.27 25.29,12.49
N$215
  Bottom 2.184: 24.56,8.65 27.41,8.65 27.66,8.41
N$216
  Bottom 2.184: 28.56,8.41 28.56,6.21 29.29,5.47 31.82,5.47 32.15,5.14 32.15,8.49 31.66,8.98 30.11,8.98 29.86,9.23 29.86,7.59 30.52,6.94
N$217
  Bottom 2.184: 27.5,10.29 31.25,10.34 31.98,9.96
N$218
  Bottom 2.184: 28.56,12 30.43,12
N$219
  Bottom 2.184: 29.54,13.31 29.54,11.68 29.7,11.51
N$221
  Bottom 0.254: 22.43,23.07 22.43,24.71 22.55,24.82
N$222
  Bottom 0.254: 22.6,26.92 22.6,29.78 22.66,30.42
N$223
  Bottom 0.254: 26.23,29.25 26.23,22.84 26.29,22.78
N$224
  Bottom 3.81: -1.53,26.58 -1.53,2.47
N$225
  Bottom 1.422: 17.07,50.94 17.07,50.71 17.43,50.35 17.66,48.88 17.7,47.04
N$226
  Bottom 1.422: 3.87,51.89 2.29,51.96 2.26,48.19 5.37,48.19 8.16,51.17
N$227
  Bottom 1.422: 7.77,53.66 7.96,54.45
N$228
  Bottom 1.422: 9.01,-0.2 24.07,-0.2 24.03,1.65
N$229
  Bottom 1.422: 28.01,0.87 31.79,0.94
N$230
  Bottom 1.422: 27.3,-0.24 51.81,-0.24
N$231
  Bottom 1.422: 34.89,2.92 51.82,2.86
N$232
  Bottom 1.422: 32.44,4.15 35.43,3.2
N$233
  Bottom 1.422: 33.39,5.51 34.69,3.74
N$234
  Bottom 1.422: 17,4.22 19.11,3.13
N$235
  Bottom 1.422: 18.5,4.42 18.98,4.08
N$236
  Bottom 1.422: 17.95,6.05 17,6.93
N$237
  Bottom 1.422: -3.04,83.3 -3.04,79.77
N$238
  Bottom 1.422: -3.13,83.3 2.94,83.3
N$239
  Bottom 0.813: 1.01,70 3.4,70
N$240
  Bottom 0.813: 3.37,71.91 3.61,71.91 3.61,71.09
N$241
  Bottom 0.813: 1.62,67.4 1.58,67.4 1.58,68.84 3.29,68.84 3.29,67.42 1.63,67.42 1.63,67.44
N$242
  Bottom 0.813: 28.64,69.29 28.62,69.29 28.62,67.56 30.56,67.56 | 30.61,67.56 30.56,67.56 | 30.56,67.56 30.56,69.34 28.64,69.34 28.64,69.01
N$243
  Bottom 0.813: 27.58,70.56 30.89,70.56 30.89,71.26
N$244
  Bottom 0.813: 52.45,62.91 54.91,62.91 54.91,62.94
N$245
  Bottom 0.813: 52.45,64.41 54.39,64.41 54.39,63.87
N$246
  Bottom 0.813: 52.54,68.61 52.61,68.61 52.61,65.63 52.94,65.63 52.94,68.19
N$247
  Bottom 0.813: 54.44,65.49 54.58,65.49 54.58,67.86 54.09,67.86 54.09,67.13
N$248
  Bottom 0.813: 54.04,70.04 54.16,70.04 54.16,68.52
N$249
  Bottom 0.813: 77.52,75.55 77.64,75.55 77.64,73.19
N$250
  Bottom 0.813: 78.11,73.12 77.99,73.12 77.99,75.39
N$251
  Bottom 0.813: 78.51,73.05 78.27,73.05 78.27,74.9
N$252
  Bottom 0.813: 78.69,73.3 78.69,74.38
N$253
  Bottom 0.813: 78.91,73.02 78.91,73.21
N$254
  Bottom 0.813: 77.29,71.31 78.83,71.31 78.83,71.38
N$255
  Bottom 0.813: 77.57,68.87 77.59,68.87 77.59,69.76
N$256
  Bottom 0.813: 77.64,70.18 79.37,70.18 79.37,70.14
N$257
  Bottom 0.813: 79.21,69.53 80.12,69.53 80.12,69.88
N$258
  Bottom 0.813: 80.31,71.1 80.34,71.1 80.34,70.89
N$259
  Bottom 0.813: 80.52,69.39 80.5,69.39 80.5,70.89
N$260
  Bottom 0.813: 76.13,63.84 76.11,63.84 76.11,65.23 76.97,65.23 76.97,65.21
N$261
  Bottom 0.813: 77.34,63.49 77.32,63.49 77.32,63.22
N$262
  Bottom 0.813: 80.23,64.23 80.29,64.23 80.29,62.87
N$263
  Bottom 0.813: 76.93,66.07 77.12,66.07 77.12,65.17
N$264
  Bottom 0.813: 76.54,65.95 76.54,65.72
N$265
  Bottom 0.813: 74.46,63.96 74.62,63.96 74.62,62.47
N$266
  Bottom 0.813: 72.76,63.39 72.74,63.39 72.74,62.4
N$267
  Bottom 0.813: 72.92,70.35 72.96,70.35 72.96,72.27
N$268
  Bottom 0.813: 73.92,71.85 73.9,71.85 73.9,72.99
N$269
  Bottom 0.813: 73.34,72.71 73.28,72.71 73.28,75.35
N$270
  Bottom 0.813: 68.91,76.67 73.18,76.67 73.18,76.25
N$271
  Bottom 0.813: 73.6,76.92 73.58,76.92 73.58,76.33
N$272
  Bottom 0.813: 72.94,75.69 72.94,75.57
N$273
  Bottom 0.813: 69.15,75.65 69.15,75.53
N$274
  Bottom 0.813: 69.13,75.57 69.17,75.57 69.17,72.56
N$275
  Bottom 0.813: 95.6,65.38 95.77,65.38 95.77,59.72
N$276
  Bottom 0.813: 95.57,68.42 95.68,68.42 95.68,65.92
N$277
  Bottom 0.813: 92.89,68.82 92.89,59.22
N$278
  Bottom 0.813: 94.16,68.4 94.3,68.4 94.3,59.7
N$279
  Bottom 0.813: 91.6,69.3 91.71,69.3 91.71,59.08
N$280
  Bottom 0.813: 85.18,69.13 85.21,69.13 85.21,60.17
N$281
  Bottom 0.813: 84.34,69.16 83.97,69.16 83.97,59.89
N$282
  Bottom 0.813: 81.89,69.33 82.59,69.33 82.59,59.98
N$283
  Bottom 0.813: 80.28,64.37 80.25,64.4 80.25,68.37
N$284
  Bottom 0.406: 81.15,42.01 81.32,42.01 | 81.32,42.01 82.48,42.01 82.85,41.64 82.85,40.62 81.72,40.62 81.31,41.03 81.31,41.99 81.32,42.01
N$285
  Bottom 0.406: 80.93,41.52 80.93,40.95 80.97,40.91
N$286
  Bottom 0.406: 80.68,41.58 80.68,40.78
N$287
  Bottom 0.406: 80.41,41.73 80.41,41.52 | 80.41,40.6 80.41,41.52 | 80.41,41.52 79.78,42.15 79.78,40.19 79.8,40.17 79.88,40.17 80.11,40.41 80.11,41.44 80.05,41.5
N$288
  Bottom 0.406: 81.36,40.56 82.81,40.56 82.84,40.65
N$289
  Bottom 0.406: 84.06,41.44 84.06,40.48 84.08,40.46 84.2,40.46 84.37,40.64 84.37,40.5 84.43,40.44 85.82,40.44 85.84,40.42 85.84,40.7 85.8,40.74 85.12,40.74 85.08,40.7 85.17,40.7 85.55,41.07 85.76,41.07 85.84,40.99 85.84,41.15 85.64,41.34 85.64,41.56 85.51,41.7 85.51,41.81 85.37,41.95 85.39,41.95 85.47,42.03 85.14,42.03 85.12,42.01 84.41,42.01 84.28,41.87 84.08,41.87 84.06,41.85 84.06,41.7 84.04,41.67
N$290
  Bottom 0.406: 84.08,39.82 84.08,38.02 84.1,38 85.64,38 85.66,38.02 85.66,39.68 85.61,39.74 84.35,39.74 84.3,39.8
N$291
  Bottom 0.406: 85.43,38.22 85.35,38.22 85.31,38.18
N$292
  Bottom 0.406: 83.96,47.38 83.96,45.9 85.47,45.9 85.47,47.38 84,47.38
N$293
  Bottom 0.406: 83.89,48.09 83.89,48.07 85.66,48.07 85.66,49.96 85.7,49.96 85.7,49.94 83.81,49.94 83.81,48.13 83.92,48.13
N$294
  Bottom 0.406: 81.48,47.44 81.48,47.5 82.95,47.5 82.95,45.84 82.97,45.84 82.97,45.88 80.97,45.88 80.97,46.91 81.09,46.91 81.09,46.15 81.28,46.15
N$295
  Bottom 0.406: 80.97,47.64 80.97,47.6 81.56,47.6
N$296
  Bottom 0.406: 80.89,47.17 80.31,47.17 80.31,47.36 80.09,47.36 79.14,48.32 78.84,48.32 78.33,48.83
N$297
  Bottom 0.406: 80.67,46.93 80.67,45.98 80.74,45.92 80.34,45.92 80.34,46.87 80.11,46.87 80.11,45.88 79.97,45.88 79.97,47.08 79.77,47.08 79.77,47.29 79.67,47.29 79.67,45.84 79.53,45.84 79.53,47.46 79.34,47.46 79.34,47.75 79.33,47.75 79.33,45.84
N$298
  Bottom 0.406: 82.37,58.95 82.53,58.95 | 82.53,58.95 84.42,58.95 | 84.42,58.95 84.42,56.6 82.53,56.6 82.53,58.95 | 84.42,58.95 84.76,58.95 84.76,56.55 84.26,56.55 84.26,56.72
N$299
  Bottom 0.406: 84.9,58.95 84.96,58.94 84.96,56.52
N$300
  Bottom 0.406: 86.2,58.99 86.21,58.99 86.21,55.82
N$301
  Bottom 0.406: 85.97,59.12 85.95,59.12 85.95,55.77 85.82,55.77 85.82,59.17
N$302
  Bottom 0.406: 85.76,55.64 90.48,55.64 90.48,56.1
N$303
  Bottom 0.406: 90.5,55.49 85.69,55.49 85.68,59.12 86.2,59.19 86.2,59.16
N$304
  Bottom 0.406: 83.77,59.66 85.17,59.66 85.17,60.43
N$305
  Bottom 0.406: 85.42,59.74 85.43,60.58
N$306
  Bottom 0.406: 82.41,58.85 82.11,58.98 82.45,57.28
N$307
  Bottom 0.406: 82.06,59.05 83.52,59.05 83.52,58.98
N$308
  Bottom 0.406: 82.1,61.62 82.14,61.62 82.14,60.07
N$309
  Bottom 0.406: 81.87,61.59 81.95,61.59 81.95,60.52
N$310
  Bottom 0.406: 81.46,61.8 81.46,61.74 81.68,61.52
N$311
  Bottom 0.406: 81.35,62.01 81.35,61.61 81.8,61.16
N$312
  Bottom 0.406: 80.32,62.46 80.28,62.42 79.71,62.42 79.98,62.15 80.35,62.15 80.54,62.34 80.54,64.89
N$313
  Bottom 0.406: 76.7,62.06 76.42,61.78 76.42,61.42 76.46,61.45 76.82,61.45 76.77,61.5 76.77,62.64 76.91,62.79 77.06,62.79 77.03,62.76 77.03,61.39 77.35,61.39 77.34,61.41 77.34,62.77 77.52,62.95 77.52,64.81 77.19,64.81
N$314
  Bottom 0.406: 76.13,65.75 76.13,65.53 76.07,65.53
N$315
  Bottom 0.406: 74.31,64.29 74.31,64.24 75.64,64.24 75.64,62.63 75.07,62.63 75.07,63.99 | 75.07,63.99 74.97,63.99 | 75.07,63.99 75.37,63.99 75.37,62.9
N$316
  Bottom 0.406: 74,64.47 75.66,64.47 75.66,65.23 75.51,65.23 75.51,64.75 74.91,64.75 74.91,64.73 75.19,64.73 75.19,65
N$317
  Bottom 0.406: 71.89,60.85 76.79,60.85 76.79,60.77
N$318
  Bottom 0.406: 77.33,61.2 77.57,61.2 77.57,61.06
N$319
  Bottom 0.406: 76.82,60.73 77.19,60.73 77.19,60.66
N$320
  Bottom 0.406: 77.73,56.51 77.78,56.51 77.78,55.85 79.23,55.85 79.23,56.98 79.21,56.98 79,57.19 79,57.61 78.93,57.68
N$321
  Bottom 0.406: 79.35,55.69 77.85,55.69 77.78,55.76
N$322
  Bottom 0.406: 75.27,56.13 76.56,56.13 76.91,55.78 76.91,55.1 76.84,55.03 76.82,55.03 76.54,54.75 75.58,54.75 75.22,55.1 75.22,56.06 75.18,56.11
N$323
  Bottom 0.406: 77.1,55.71 77.1,55.03 76.82,54.75 75.29,54.75 74.85,55.2 74.85,56.16 75.9,56.16 76.09,56.34
N$324
  Bottom 0.406: 69.53,55.48 74.56,55.48 74.73,55.31 69.42,55.31 69.26,55.48
N$325
  Bottom 0.406: 74.73,55.11 69.05,55.11 68.85,55.31
N$326
  Bottom 0.406: 70.38,59.4 70.38,57.61 70.9,57.09
N$327
  Bottom 0.406: 67.84,59.61 67.84,55.54 68.22,55.17
N$328
  Bottom 0.406: 81.34,54.87 81.34,53.51 81.36,53.49 82.99,53.49 83.02,53.52 | 83.02,53.52 83.02,54.89 81.38,54.89 81.33,54.94 81.33,55.17 81.31,55.18 82.95,55.18 83,55.13 83,55.41 82.97,55.44 81.29,55.44 81.28,55.43 81.28,55.72 81.29,55.74 83,55.74 83.02,55.72 83.02,53.52 | 83.02,53.52 83.07,53.47
N$329
  Bottom 0.406: 83.88,53.44 83.88,55.61 83.87,55.62 84.75,55.62 84.93,55.44 84.93,55.07 84.96,55.04 84.22,55.04 84.18,54.99 84.18,55.27 84.14,55.3 84.6,55.3
N$330
  Bottom 0.406: 83.87,53.42 85.97,53.42 85.98,53.41 85.98,54.74 85.45,54.74 85.41,54.71 85.33,54.71 85.01,55.04 85.01,55 85.45,54.56 85.58,54.56 85.67,54.47 85.67,53.75 85.63,53.7
N$331
  Bottom 0.406: 80.95,52.25 83.08,52.25 83.08,50.98 83.06,50.97 80.02,50.97 79.48,51.51 79.77,51.51 80.09,51.2 81.39,51.2 81.42,51.16 81.42,51.9 81.33,51.99 80,51.99 79.94,52.05 79.94,52.1 79.81,52.24 79.98,52.24 80.11,52.1 80.69,52.1 80.7,52.11
N$332
  Bottom 0.406: 80.09,50.81 83.09,50.81
N$333
  Bottom 0.406: 80.22,50.13 83.04,50.13 83.05,50.15 83.05,48.15 83.06,48.14 81.85,48.14 81.75,48.24 81.17,48.24 81.13,48.29 81.13,49.69 81.31,49.87 80.97,49.87 80.95,49.85 80.95,48.37 80.98,48.34 80.93,48.34 80.6,48.66 80.6,49.79 80.58,49.82 80.58,49.61 80.36,49.4 80.36,48.87 80.42,48.81 80.41,48.81 79.97,49.25 79.97,49.4 80.04,49.48 79.76,49.48 79.26,49.98 79.11,49.98
N$334
  Bottom 0.406: 83.73,50.71 85.45,50.71 85.46,50.72 85.46,52.17 85.44,52.19
N$335
  Bottom 0.406: 85.43,52.23 83.78,52.23 83.78,50.74 83.75,50.72 83.78,50.72 84.05,50.99 85.19,50.99 85.28,50.9
N$336
  Bottom 0.406: 85.73,52.28 85.73,50.73 85.77,50.7 86.02,50.7 86.03,50.71 86.03,52.24 86.04,52.25 86.33,52.25 86.34,52.24 86.34,50.71 86.35,50.7
N$337
  Bottom 0.406: 85.89,49.99 85.89,48.09 85.87,48.07 86.18,48.07 86.18,49.97 86.4,49.97 86.42,49.96 86.42,48.1 86.4,48.09
N$338
  Bottom 0.406: 85.75,47.41 85.74,45.91 85.73,45.9 86.02,45.9 86.04,45.92 86.04,47.4 86.05,47.41 86.33,47.41 86.34,47.4 86.34,45.91 86.33,45.9 86.6,45.9 86.61,45.91 86.61,47.4 86.6,47.41
N$339
  Bottom 0.406: 81.29,44.59 83,44.59 83.01,44.58 83.01,43.33 83.03,43.3
N$340
  Bottom 0.406: 83,43.35 81.49,43.35 81.48,43.36 81.48,43.39 81.32,43.55 81.32,44.19 | 81.32,44.31 81.32,44.19 | 81.32,44.19 81.08,43.95 81.08,44.21 81.17,44.3 81.17,43.84 81.23,43.79
N$341
  Bottom 0.406: 83.75,44.6 85.47,44.6 85.66,44.41 85.66,43.48 85.54,43.36 84.48,43.36 84.17,43.67 84.17,43.69 83.71,44.15 83.71,44.6 83.77,44.6 84,44.37
N$342
  Bottom 0.406: 85.46,44.37 85.46,43.71 85.52,43.65
N$343
  Bottom 0.406: 85.91,44.3 85.91,43.36
N$344
  Bottom 0.406: 86.16,44.08 86.06,43.36 84.5,43.35 84.44,43.41
N$345
  Bottom 0.406: 81,39.68 82.81,39.68 82.82,39.67 82.82,38.06 80.83,38.06 80.81,38.08 80.81,39.48 80.98,39.65 80.98,39.52 81.1,39.4 81.1,38.4 81.14,38.37
N$346
  Bottom 0.406: 83.05,37.28 81.22,37.28 81.21,37.27 81.21,35.42 81.22,35.42 83.09,35.42 83.1,35.43 83.1,37.27 83.11,37.29
N$347
  Bottom 0.406: 81.29,37.27 80.86,37.27 80.85,37.27 80.85,35.27 81.09,35.03 83.11,35.03 83.13,35.05
N$348
  Bottom 0.406: 84.16,37.27 85.32,37.27 85.85,36.74 85.85,35.92 85.27,35.34 84.16,35.34 84,35.5 84,36.88 84.1,36.98
N$349
  Bottom 0.406: 85.62,36.75 85.62,36.54 85.63,36.53
N$350
  Bottom 0.406: 85.25,37.28 85.65,37.28 85.9,37.03 85.9,35.28 83.99,35.28 83.98,35.28
N$351
  Bottom 0.406: 83.79,36.66 83.79,35.37 83.83,35.33
N$352
  Bottom 0.406: 83.79,35.07 85.87,35.07 85.9,35.1
N$353
  Bottom 0.406: 81.25,33.92 85.8,33.92 85.8,30.21 85.82,30.2 81.26,30.2 81.26,33.65 85.43,33.65 85.51,33.57 85.51,30.51 85.45,30.44 81.67,30.44 81.56,30.56 81.56,33.31 81.54,33.33 85.27,33.33 85.28,33.31 85.28,30.77 85.27,30.75 81.85,30.75 81.77,30.83 81.77,32.88 81.9,33.02 82.21,33.02 82.22,33.03 82.22,32.15 82.79,31.58 84.47,31.58 84.47,32.74 84.76,33.03 84.94,33.03 84.94,31.06 84.93,31.05 82.12,31.05 82.09,31.08 82.09,32.62 81.98,32.74 81.98,32.09 82.58,31.48 84.63,31.48 84.68,31.44 84.68,32.36 84.71,32.4 84.71,31.44 84.62,31.34 82.34,31.34 82.32,31.32
N$354
  Bottom 0.406: 81,33.98 81,30.21 81.07,30.15 87.71,30.15 87.74,30.12 87.74,30.39 87.71,30.43 86.18,30.43 86.15,30.46 86.15,31.26 86.06,31.34 | 86.06,31.34 | 86.06,31.34 86.83,30.57 86.47,30.57 86.39,30.65 87.53,30.65 87.71,30.48
N$355
  Bottom 0.406: 75.36,40.83 75.36,39.65 75.44,39.56 76.76,39.56 76.79,39.59 76.79,40.74 76.71,40.83 75.55,40.83 75.47,40.91
N$356
  Bottom 0.406: 77.81,41.87 77.81,40.63 79.04,40.63 79.1,40.69 79.1,41.76 79.02,41.84 78.03,41.84 78,41.87
N$357
  Bottom 0.406: 78.99,42.15 77.58,42.15 77.55,42.18 77.55,40.38 77.58,40.35 79.04,40.35 79.16,40.46
N$358
  Bottom 0.406: 76.79,39.37 75.36,39.37 75.3,39.31 75.3,40.94 75.24,41 75.13,41 75.05,40.91 75.05,39.37 75.19,39.22
N$359
  Bottom 0.406: 75.1,41.08 76.74,41.08 76.76,41.05
N$360
  Bottom 0.406: 90.74,36.24 89.39,36.24 89.37,36.22 89.37,34.25 91.23,34.25 91.23,36.26 91.19,36.29 90.1,36.29 89.7,35.88 89.7,34.53 89.66,34.5 90.94,34.5 90.95,34.51 90.95,35.98 90.94,36 90.74,36 90.74,34.81 90.77,34.77 90.01,34.77 89.96,34.73
N$361
  Bottom 0.406: 95.79,30.41 94.22,30.41 94.21,30.39 94.21,29.29 94.29,29.2 94.47,29.2 94.61,29.35 94.61,30.1 94.58,30.13 94.86,30.13 94.89,30.1
N$362
  Bottom 0.406: 95.89,30.44 95.95,30.44 96.21,30.18 96.21,28.89 96.16,28.85 95.09,28.85 95.04,28.8 95.04,29.04 95.06,29.06 95.8,29.06 95.98,29.24
N$363
  Bottom 0.406: 93.13,26.94 91.47,26.94 91.42,26.89 91.42,25.34 91.44,25.33 91.44,25.52 92.03,26.11 92.03,26.47 92.19,26.63 91.75,26.63 91.73,26.61 91.73,26.22 91.8,26.16
N$364
  Bottom 0.406: 91.77,26.11 91.7,26.11 91.68,26.09
N$365
  Bottom 0.406: 93.08,26.96 94.08,26.96 94.11,26.92 94.11,24.76 94.09,24.74 91.72,24.74 91.64,24.66 91.75,24.66 92.55,25.46 93.83,25.46 93.87,25.43 93.87,25.05 93.88,25.04 92.45,25.04 92.42,25.07 92.56,25.07 92.71,25.21 93.72,25.21 93.72,26.63 93.78,26.7 93.34,26.7 93.33,26.68 93.33,25.77 93.36,25.73
N$366
  Bottom 0.406: 92.43,42.1 91.49,42.1 91.49,40.83 91.52,40.8 94.21,40.8 94.24,40.83 94.24,42.06 94.27,42.09 93.08,42.09 93.07,42.1 92.11,42.1 91.72,41.71 91.72,41.11 91.81,41.01 92.11,41.01 92.12,41.03 92.12,41.83 92.09,41.86 93.56,41.86 93.59,41.83 94.03,41.83 94.13,41.73 94.13,41.29 93.93,41.09 93.54,41.09 93.47,41.03 93.47,41.53 93.59,41.65 93.61,41.65 93.78,41.47
N$367
  Bottom 0.406: 91.44,40.56 94.21,40.56 94.26,40.61
N$368
  Bottom 0.406: 95.22,45.6 94.2,45.6 94.15,45.55 94.15,44.16 94.2,44.1 96.47,44.1 96.49,44.12 96.49,45.56 96.51,45.59 95.18,45.59 95.12,45.53 94.75,45.53 94.56,45.33 94.56,44.39 94.54,44.37 96.22,44.37 96.22,45.29 96.18,45.33 94.77,45.33 94.65,45.21 94.65,44.8 94.85,44.61 95.83,44.61 95.94,44.49
N$369
  Bottom 0.406: 94.3,45.88 96.47,45.88 96.49,45.86 96.3,45.86 96.02,46.13 94.97,46.13 94.95,46.15
N$370
  Bottom 0.406: 89.25,20.88 91.9,20.88 91.9,19.89 90.59,18.58 89.06,18.58 89.06,20.76 89.16,20.85 91.38,20.85 91.67,20.57 91.67,20.1 90.45,18.88 89.67,18.88 89.6,18.81 89.6,19.3 89.37,19.54 89.37,20.57 91.2,20.57 91.24,20.62 91.24,20.31 91.36,20.2 91.36,20.15 90.33,19.12 90.02,19.12 89.95,19.19 89.95,19.21 90.16,19.42 90.4,19.42 90.42,19.45 90.66,19.45 91.1,19.89 91.1,20.1 90.94,20.27
N$371
  Bottom 0.406: 65.47,32.79 65.47,31.01 65.7,30.78 67.01,30.78 67.04,30.8 67.04,32.89 67.01,32.91 65.72,32.91 65.65,32.84 65.65,32.7 65.75,32.6 66.71,32.6 66.73,32.58 66.73,31.22 66.71,31.2 66.71,31.13 66.8,31.03 65.82,31.03 65.77,31.08 65.77,31.36 65.79,31.39 65.91,31.39 65.98,31.32
N$372
  Bottom 0.406: 69.19,31.32 69.19,29.2 69.17,29.18 68.33,29.18 68.3,29.2 68.3,29.23 67.86,29.67 67.86,30.38 67.93,30.45 67.93,31.17 68.4,31.64 68.4,31.43 68.54,31.29 68.44,31.29 68.23,31.08 68.23,30.7 68.26,30.68 68.26,29.46 69.01,29.46 69.03,29.44
N$373
  Bottom 0.406: 69.43,30.47 69.43,29.58 69.45,29.56
N$374
  Bottom 0.406: 70.37,30.52 70.37,26.16 70.44,26.08 71.49,26.08 71.59,26.18 71.59,28.22 71.49,28.31 71.49,28.52 71.31,28.71 71.31,29.25 71.89,29.84 71.89,30.66 71.84,30.7 70.44,30.7 70.37,30.64 70.37,29.63 70.6,29.39 70.6,28.69 70.74,28.55 70.74,28.48 70.58,28.31
N$375
  Bottom 0.406: 69.24,28.36 69.24,26.11 69.27,26.08
N$376
  Bottom 0.406: 69.38,28.41 69.38,26.01 69.36,25.99
N$377
  Bottom 0.406: 69.31,25.99 67.95,25.99 67.91,26.04 67.91,28.48 69.36,28.48 69.38,28.45
N$378
  Bottom 0.406: 71.21,25.94 71.21,25.17 70.98,24.93
N$379
  Bottom 0.406: 68.22,50.59 70.35,50.59 70.37,50.61 70.37,48.93 68.15,48.93 68.15,50.56 68.14,50.57 69.75,50.57 70.09,50.23 70.09,49.27 70.04,49.22 68.54,49.22 68.48,49.29 68.48,50.3 68.49,50.31
N$380
  Bottom 0.406: 68.48,50.88 70.09,50.88 70.16,50.82
N$381
  Bottom 0.406: 68.72,51.14 69.99,51.14 69.98,51.1
N$382
  Bottom 0.406: 71.08,50.77 71.08,48.98 71.2,48.86 74.93,48.86 74.96,48.9 74.96,50.75 74.87,50.82 71.07,50.82 71.1,50.79 71.08,50.77 | 71.08,50.77 71.13,50.8 71.34,50.51 71.34,49.22 71.42,49.14 74.39,49.14 74.42,49.17 74.42,49.34 74.39,49.37 72.42,49.37 72.35,49.3 72.35,50.52 72.29,50.59 74.58,50.59 74.72,50.46 74.72,50.15 74.7,50.13 72.74,50.13 72.63,50.25 74.28,50.25 74.36,50.33
N$383
  Bottom 0.406: 68.15,47.81 68.15,47.87 68.42,48.14 70.3,48.14 70.35,48.09 70.35,46.79 70.3,46.73 68.51,46.73 68.35,46.89 68.33,46.89 68.09,47.12 68.09,47.73 68.11,47.75 68.51,47.75 68.59,47.83 70.01,47.83 70.06,47.78 70.06,47.05 70.1,47 68.54,47 68.36,47.18 68.36,47.38 68.33,47.42
N$384
  Bottom 0.406: 71.09,48.1 71.09,46.64 71.24,46.49 72.43,46.49 72.45,46.47 73.53,46.47 73.54,48.15 73.54,48.16 71.16,48.16 71.1,48.17 71.18,48.13 71.31,48.11 73.14,48.11 73.23,48.02 73.23,46.78 73.19,46.74 72.4,46.74 72.4,46.86 72.64,47.09 72.64,47.67 72.5,47.8 72.91,47.8 72.93,47.82 72.93,47.14 72.87,47.08
N$385
  Bottom 0.406: 68.37,45.46 69.89,45.46 69.89,44.03 69.72,43.86 67.34,43.86 67.33,43.88 67.33,45.04 67.46,45.17 67.67,45.17 67.83,45.33 68.22,45.33 68.36,45.47 68.36,44.46 68.74,44.08 67.73,44.08 67.64,44.16 67.64,44.93 67.65,44.94 67.91,44.94 68,45.03 68,44.45 68.25,44.2
N$386
  Bottom 0.406: 69.65,44.11 69.65,44.02 69.67,43.99
N$387
  Bottom 0.406: 71.14,46.84 71.14,38.7 71.18,38.66 72.92,38.66 73.45,39.19 73.45,46.09 73.62,46.27 73.35,46.27 73.23,46.15 71.45,46.15 71.44,46.13 71.44,39.02 71.57,38.88 72.67,38.88 73.17,39.39 73.17,45.82 73.16,45.84 72.24,45.84 72.18,45.9 72.18,39.95 72.76,39.37 72.76,39.49 72.92,39.64 72.92,45.37 72.7,45.59 72.53,45.59 72.51,45.56 73,45.56 73.02,45.59 72.78,45.59 72.43,45.23 72.43,40.07 72.72,39.78 72.72,45.13 72.7,45.16
N$388
  Bottom 0.406: 73.48,48.13 73.8,48.13 73.8,39.06 73.35,38.6 73.4,38.6 73.72,38.28 73.72,38.55 73.97,38.8 73.97,38.16 73.84,38.03 73.84,37.58 74,37.41 74,47.95 73.72,48.23 73.72,47.79 74.26,47.25 74.26,41.81 74.36,41.71 75.14,41.71 75.25,41.83 75.25,47.4 75.28,47.43 74.23,47.43 74.23,47.41 74.57,47.07 74.57,42.02 74.5,41.96 74.88,41.96 74.91,41.99 74.91,47.1 74.88,47.14
N$389
  Bottom 0.406: 73.02,47.01 73.04,47.01 73.12,46.93
N$390
  Bottom 0.406: 74.11,41.32 74.14,41.32 74.42,41.6
N$391
  Bottom 0.406: 67.4,42.98 67.42,42.98 | 67.42,42.98 70.25,42.98 70.35,42.89 70.35,41.44 70.37,41.42 66.77,41.42 66.75,41.4 66.75,42.32 67.42,42.98 | 67.42,42.98 67.42,42.8 67.6,42.63 70.06,42.63 70.06,41.78 69.86,41.58 67.45,41.58 67.03,42.01 67.03,42.09 67.39,42.45 68.25,42.45 68.36,42.33 68.09,42.33 67.78,42.02 67.4,42.02 67.39,42.04 67.39,42.07 67.55,42.23
N$392
  Bottom 0.406: 67.24,40.46 70.33,40.46 70.35,40.44 70.35,38.63 70.37,38.62 67.57,38.62 67.31,38.88 67.31,40.23 70.01,40.23 70.06,40.18 70.06,38.93 70.01,38.88 67.83,38.88 67.6,39.11 67.6,39.82 67.58,39.84 68.49,39.84 68.51,39.86 68.51,39.69 68.28,39.47 68.07,39.47 67.92,39.32 67.92,39.38 | 67.92,39.6 67.92,39.38 | 67.92,39.38 68.41,38.9 69.67,38.9 69.89,39.12
N$393
  Bottom 0.406: 52.44,59.25 53.86,59.25 54.37,58.74 54.37,57.82 54.33,57.78 52.34,57.78 52.32,57.8 52.32,58.99 52.3,59.01 53.77,59.01 54.12,58.66 54.12,58.02 52.59,58.02 52.55,57.98 52.55,58.64 52.67,58.76
N$394
  Bottom 0.406: 60.22,59.74 60.22,57.27 60.3,57.2 62.01,57.2 62.01,60.15 60.33,60.15 60.21,59.97 61.62,59.97 61.74,59.85
N$395
  Bottom 0.406: 59.38,60.14 59.38,57.33 59.18,57.14 57.68,57.14 57.66,57.12 57.66,60.13 57.64,60.15 59.18,60.15 59.28,60.05
N$396
  Bottom 0.406: 56.87,60.07 56.87,57.36 56.6,57.09 55.44,57.09 55.19,57.34 55.19,59.83 55.44,60.07 56.57,60.07 56.7,59.94
N$397
  Bottom 0.406: 60.25,69.06 60.25,83.29 60.41,83.45 61.63,83.45 61.71,83.37 61.71,68.94 61.67,68.9 60.25,68.9 60.21,68.94
N$398
  Bottom 0.406: 60.37,83.09 61.55,83.09 61.55,83.01 61.35,82.81
N$399
  Bottom 0.406: 61.51,82.72 61.51,82.24 61.47,82.2
N$400